# Altium schematic sheet overview.SchDoc
size A4
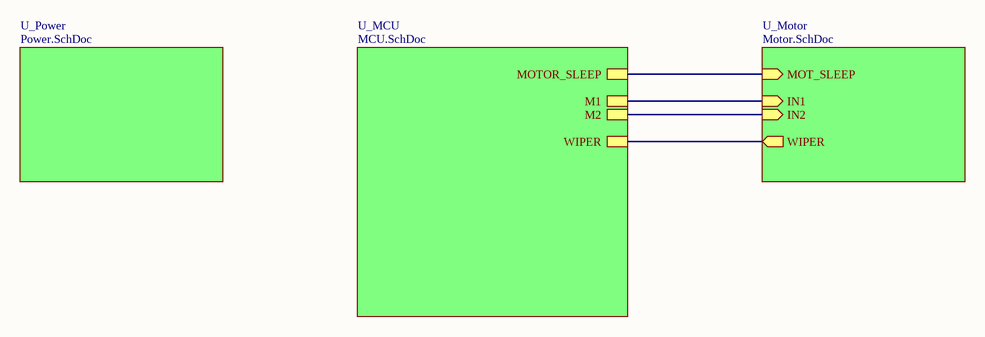
[diagram p0: overview.SchDoc]

## Sub-sheets
U_MCU = MCU.SchDoc: WIPER, M1, M2, MOTOR_SLEEP
U_Motor = Motor.SchDoc: WIPER (out), MOT_SLEEP (in), IN1 (in), IN2 (in)
U_Power = Power.SchDoc: no entries

## Nets
(unnamed): sheet U_MCU/WIPER, sheet U_Motor/WIPER
(unnamed): sheet U_MCU/M1, sheet U_Motor/IN1
(unnamed): sheet U_MCU/M2, sheet U_Motor/IN2
(unnamed): sheet U_MCU/MOTOR_SLEEP, sheet U_Motor/MOT_SLEEP